# EAGLE schematic PLACA_MAGO (EAGLE 9.6.2)
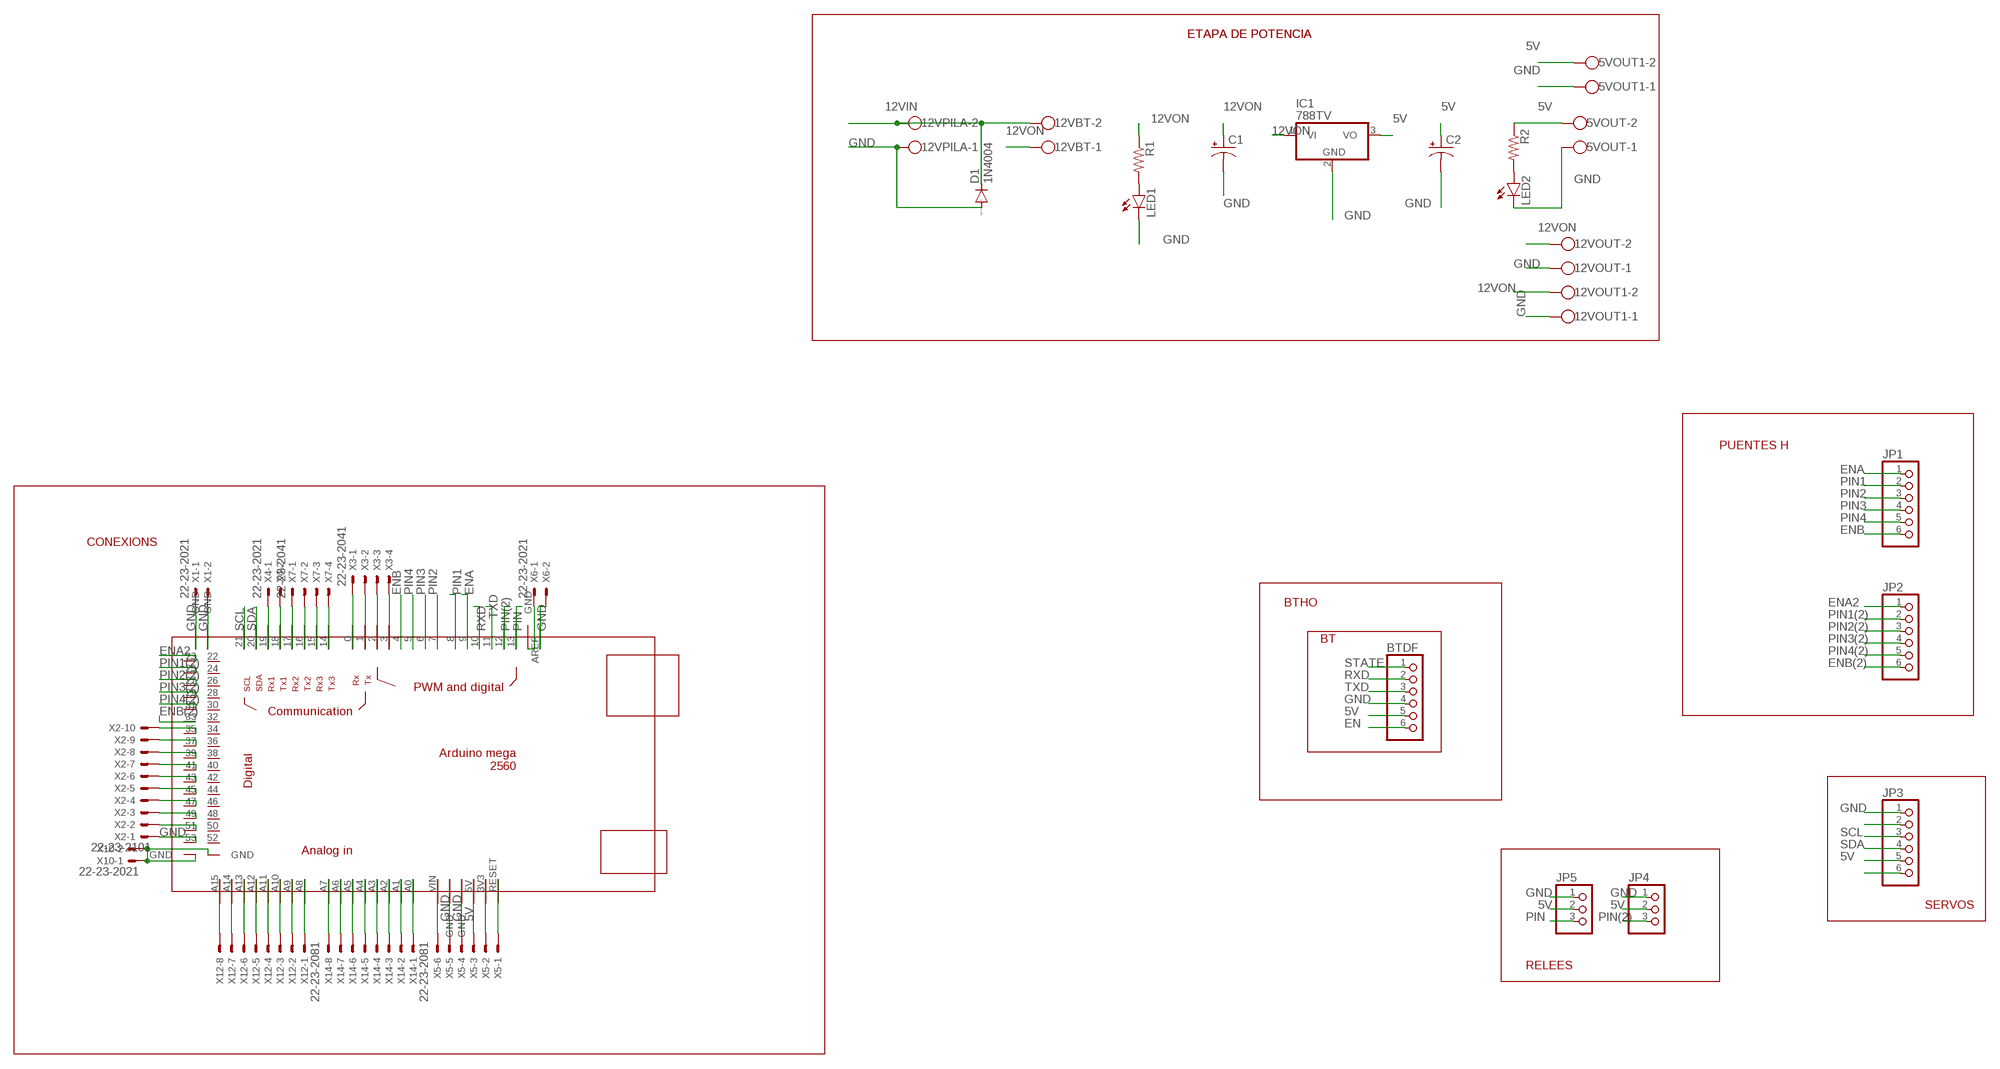
[diagram p0: schematic, sheet 1]

## Parts
5VOUT  W237-102  [W237-102]
5VOUT1  W237-102  [W237-102]
12VBT  W237-102  [W237-102]
12VOUT  W237-102  [W237-102]
12VOUT1  W237-102  [W237-102]
12VPILA  W237-102  [W237-102]
BTDF  PINHD-1X6  [1X06]
C1  CPOL-USE1.8-4  [E1,8-4]
C2  CPOL-USE1.8-4  [E1,8-4]
D1  1N4004  [DO41-10]
IC1  788TV  [TO220V]
JP1  PINHD-1X6  [1X06]
JP2  PINHD-1X6  [1X06]
JP3  PINHD-1X6  [1X06]
JP4  PINHD-1X3  [1X03]
JP5  PINHD-1X3  [1X03]
LED1  LED5MM  [LED5MM]
LED2  LED5MM  [LED5MM]
R1  R-US_0204/7  [0204/7]
R2  R-US_0204/7  [0204/7]
U$1  MEGA_DEVICE  [MEGAOUTLINE]
X1  22-23-2021  [22-23-2021]
X2  22-23-2101  [22-23-2101]
X3  22-23-2041  [22-23-2041]
X4  22-23-2021  [22-23-2021]
X5  22-23-2061  [22-23-2061]
X6  22-23-2021  [22-23-2021]
X7  22-23-2041  [22-23-2041]
X10  22-23-2021  [22-23-2021]
X12  22-23-2081  [22-23-2081]
X14  22-23-2081  [22-23-2081]

## Nets
5V: 5VOUT1.2 5VOUT.2 BTDF.5 C2.+ IC1.3(VO) JP3.5 JP4.2 JP5.2 R2.1 U$1.5V X5.3
12VIN: 12VBT.2 12VPILA.2 D1.C
12VON: 12VBT.1 12VOUT1.2 12VOUT.2 C1.+ IC1.1(VI) R1.1
EN: BTDF.6
ENA: JP1.1 U$1.9
ENA2: JP2.1 U$1.23
ENB: JP1.6 U$1.4
ENB(2): JP2.6 U$1.33
GND: 5VOUT1.1 5VOUT.1 12VOUT1.1 12VOUT.1 12VPILA.1 BTDF.4 C1.- C2.- D1.A IC1.2(GND) JP3.1 JP4.1 JP5.1 LED1.K(C) LED2.K(C) U$1.GND@1(GND) U$1.GND@2(GND) U$1.GND@3(GND) U$1.GND@4(GND) U$1.GND@5(GND) U$1.GND@6(GND) U$1.GND@7(GND) X1.1 X1.2 X5.4 X5.5 X6.1 X10.1 X10.2
N$1: LED1.A R1.2
N$2: U$1.35 X2.10
N$3: U$1.37 X2.9
N$4: U$1.17 X7.1
N$5: LED2.A R2.2
N$6: U$1.16 X7.2
N$7: U$1.15 X7.3
N$8: U$1.14 X7.4
N$9: U$1.0 X3.1
N$10: U$1.1 X3.2
N$11: U$1.2 X3.3
N$12: U$1.3 X3.4
N$13: U$1.19 X4.1
N$14: U$1.18 X4.2
N$17: U$1.39 X2.8
N$18: JP3.2
N$19: U$1.41 X2.7
N$20: U$1.43 X2.6
N$21: U$1.45 X2.5
N$22: JP3.6
N$23: U$1.AREF X6.2
N$24: U$1.A15 X12.8
N$25: U$1.A14 X12.7
N$26: U$1.A13 X12.6
N$27: U$1.A12 X12.5
N$28: U$1.A11 X12.4
N$29: U$1.A10 X12.3
N$30: U$1.A9 X12.2
N$31: U$1.A8 X12.1
N$32: U$1.A7 X14.8
N$33: U$1.A6 X14.7
N$34: U$1.A5 X14.6
N$35: U$1.A4 X14.5
N$36: U$1.A3 X14.4
N$37: U$1.A2 X14.3
N$38: U$1.A1 X14.2
N$39: U$1.A0 X14.1
N$40: U$1.VIN X5.6
N$41: U$1.47 X2.4
N$42: U$1.49 X2.3
N$43: U$1.51 X2.2
N$44: U$1.3V3 X5.2
N$45: U$1.RESET X5.1
N$46: U$1.53 X2.1
PIN: JP5.3 U$1.13
PIN1: JP1.2 U$1.8
PIN1(2): JP2.2 U$1.25
PIN2: JP1.3 U$1.7
PIN2(2): JP2.3 U$1.27
PIN3: JP1.4 U$1.6
PIN3(2): JP2.4 U$1.29
PIN4: JP1.5 U$1.5
PIN4(2): JP2.5 U$1.31
PIN(2): JP4.3 U$1.12
RXD: BTDF.2 U$1.10
SCL: JP3.3 U$1.21
SDA: JP3.4 U$1.20
STATE: BTDF.1
TXD: BTDF.3 U$1.11
Unconnected: U$1.22 U$1.24 U$1.26 U$1.28 U$1.30 U$1.32 U$1.34 U$1.36 U$1.38 U$1.40 U$1.42 U$1.44 U$1.46 U$1.48 U$1.50 U$1.52

## Notes on the sheet
- ETAPA DE POTENCIA | ETAPA DE POTENCIA
- PUENTES H
- CONEXIONS
- BTHO
- BT
- SERVOS
- RELEES

## Library data of the parts
5VOUT 5VOUT1 12VBT 12VOUT 12VOUT1 12VPILA = con-wago-500:W237-102: WAGO SCREW CLAMP; MPN: 237-102; OC_FARNELL: unknown; OC_NEWARK: 70K9898
BTDF = adafruit:PINHD-1X6: PIN HEADER
C1 C2 = rcl:CPOL-US: POLARIZED CAPACITOR, American symbol; SPICEPREFIX: C
D1 = diode:1N4004: DIODE general purpose rectifier, 1 A
IC1 = linear:78*: Positive VOLTAGE REGULATOR Source: http://cache.national.com/ds/LM/LM78L05.pdf http://www.fairchildsemi.com/ds/LM/LM7805.pdf
JP1-JP3 = pinhead:PINHD-1X6: PIN HEADER
JP4 JP5 = pinhead:PINHD-1X3: PIN HEADER
LED1 LED2 = led:LED: LED OSRAM: - CHIPLED LG R971, LG N971, LY N971, LG Q971, LY Q971, LO R971, LY R971 LH N974, LH R974 LS Q976, LO Q976, LY Q976 LO Q996 - Hyper CHIPLED LW Q18S LB Q993, LB Q99A, LB R99A - SideLED LS A670, LO A670, LY A670, LG A670, LP A670 LB A673, LV A673, LT A673, LW A673 LH A674 LY A675 LS A676, LA A676, LO A676, LY A676, LW A676 LS A679, LY A679, LG A679 - Hyper Micro SIDELED® LS Y876, LA Y876, LO Y876, LY Y876 LT Y87S - SmartLED LW L88C, LW L88S LB L89C, LB L89S, LG L890 LS L89K, LO L89K, LY L89K LS L896, LA L896, LO L896, LY L896 - TOPLED LS T670, LO T670, LY T670, LG T670, LP T670 LSG T670, LSP T670, LSY T670, LOP T670, LYG T670 LG T671, LOG T671, LSG T671 LB T673, LV T673, LT T673, LW T673 LH T674 LS T676, LA T676, LO T676, LY T676, LB T676, LH T676, LSB T676, LW T676 LB T67C, LV T67C, LT T67C, LS T67K, LO T67K, LY T67K, LW E67C LS E67B, LA E67B, LO E67B, LY E67B, LB E67C, LV E67C, LT E67C LW T67C LS T679, LY T679, LG T679 LS T770, LO T770, LY T770, LG T770, LP T770 LB T773, LV T773, LT T773, LW T773 LH T774 LS E675, LA E675, LY E675, LS T675 LS T776, LA T776, LO T776, LY T776, LB T776 LHGB T686 LT T68C, LB T68C - Hyper Mini TOPLED® LB M676 - Mini TOPLED Santana® LG M470 LS M47K, LO M47K, LY M47K Source: http://www.osram.convergy.de LUXEON: - LUMILED® LXK2-PW12-R00, LXK2-PW12-S00, LXK2-PW14-U00, LXK2-PW14-V00 LXK2-PM12-R00, LXK2-PM12-S00, LXK2-PM14-U00 LXK2-PE12-Q00, LXK2-PE12-R00, LXK2-PE12-S00, LXK2-PE14-T00, LXK2-PE14-U00 LXK2-PB12-K00, LXK2-PB12-L00, LXK2-PB12-M00, LXK2-PB14-N00, LXK2-PB14-P00, LXK2-PB14-Q00 LXK2-PR12-L00, LXK2-PR12-M00, LXK2-PR14-Q00, LXK2-PR14-R00 LXK2-PD12-Q00, LXK2-PD12-R00, LXK2-PD12-S00 LXK2-PH12-R00, LXK2-PH12-S00 LXK2-PL12-P00, LXK2-PL12-Q00, LXK2-PL12-R00 Source: www.luxeon.com KINGBRIGHT: KA-3528ASYC Source: www.kingbright.com
R1 R2 = rcl:R-US_: RESISTOR, American symbol; SPICEPREFIX: R
U$1 = ArduinoMegaOutline:MEGA_DEVICE: mega card as device
X1 X4 X6 X10 = con-molex:22-23-2021: .100" (2.54mm) Center Header - 2 Pin; MF: MOLEX; MPN: 22-23-2021; OC_FARNELL: 1462926; OC_NEWARK: 25C3832
X2 = con-molex:22-23-2101: .100" (2.54mm) Center Header - 10 Pin; MF: MOLEX; MPN: 22-23-2101; OC_FARNELL: 1756828; OC_NEWARK: 94C0765
X3 X7 = con-molex:22-23-2041: .100" (2.54mm) Center Header - 4 Pin; MF: MOLEX; MPN: 22-23-2041; OC_FARNELL: 1462920; OC_NEWARK: 38C0355
X5 = con-molex:22-23-2061: .100" (2.54mm) Center Header - 6 Pin; MF: MOLEX; MPN: 22-23-2061; OC_FARNELL: 1462922; OC_NEWARK: 27C1933
X12 X14 = con-molex:22-23-2081: .100" (2.54mm) Center Header - 8 Pin; MF: MOLEX; MPN: 22-23-2081; OC_FARNELL: 1756826; OC_NEWARK: 01C7592